# EAGLE design ESP8266_dev (EAGLE 8.0.2)
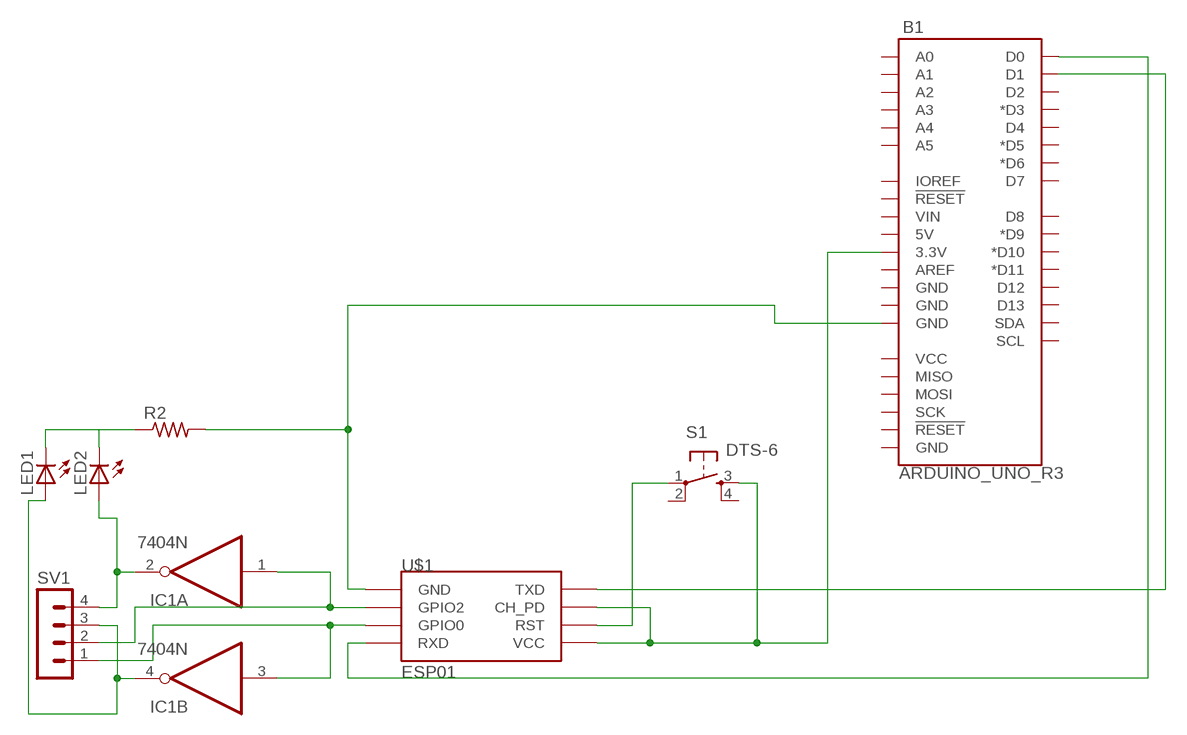
[diagram p0: schematic, sheet 1]

## Parts
B1  ARDUINO_UNO_R3  [ARDUINO_R3]
IC1  7404N  [DIL14]
LED1  LED3MM  [LED3MM]
LED2  LED3MM  [LED3MM]
R2  R-US_0207/15  [0207/15]
S1  DTS-6  [DTS-6]
SV1  MA04-1  [MA04-1]
U$1  ESP01  [ESP01]

## Nets
N$1: B1.3.3V S1.3 U$1.CH_PD U$1.VCC
N$2: S1.1 U$1.RST
N$3: B1.D1 U$1.TX(TXD)
N$4: B1.D0 U$1.RX(RXD)
N$5: B1.GND@2(GND) R2.2 U$1.GND
N$6: IC1.1(A:I) SV1.2 U$1.GPIO2
N$7: IC1.3(B:I) SV1.1 U$1.GPIO0
N$8: IC1.4(B:O) LED1.A SV1.3
N$9: IC1.2(A:O) LED2.A SV1.4
N$10: LED1.K(C) LED2.K(C) R2.1
Unconnected: B1.5V B1.A0 B1.A1 B1.A2 B1.A3 B1.A4 B1.A5 B1.AREF B1.D2 B1.D3(*D3) B1.D4 B1.D5(*D5) B1.D6(*D6) B1.D7 B1.D8 B1.D9(*D9) B1.D10(*D10) B1.D11(*D11) B1.D12 B1.D13 B1.GND@1(GND) B1.GND@3(GND) B1.GND@4(GND) B1.IOREF B1.MISO B1.MOSI B1.RESET@1(!RESET!) B1.RESET@2(!RESET!) B1.SCK B1.SCL B1.SDA B1.VCC B1.VIN IC1.5(C:I) IC1.6(C:O) IC1.8(D:O) IC1.9(D:I) IC1.10(E:O) IC1.11(E:I) IC1.12(F:O) IC1.13(F:I) S1.2 S1.4

## Power pins joined to a net without a drawn wire
GND: IC1.7(P:GND)
VCC: IC1.14(P:VCC)

## Library data of the parts
B1 = SparkFun-Boards:ARDUINO_UNO_R3: Arduino R3 Footprint with SPI header Arduino Uno R3 Compatible Footprint. Matches PCB size of the original board. SparkFun Products: SAMD21 Dev Breakout <https://www.sparkfun.com/products/13672> RedBoard <https://www.sparkfun.com/products/12757> R3 Stackable Headers <https://www.sparkfun.com/products/11417>
IC1 = 74xx-us:74*04: Hex INVERTER
LED1 LED2 = led:LED: LED OSRAM: - CHIPLED LG R971, LG N971, LY N971, LG Q971, LY Q971, LO R971, LY R971 LH N974, LH R974 LS Q976, LO Q976, LY Q976 LO Q996 - Hyper CHIPLED LW Q18S LB Q993, LB Q99A, LB R99A - SideLED LS A670, LO A670, LY A670, LG A670, LP A670 LB A673, LV A673, LT A673, LW A673 LH A674 LY A675 LS A676, LA A676, LO A676, LY A676, LW A676 LS A679, LY A679, LG A679 - Hyper Micro SIDELED® LS Y876, LA Y876, LO Y876, LY Y876 LT Y87S - SmartLED LW L88C, LW L88S LB L89C, LB L89S, LG L890 LS L89K, LO L89K, LY L89K LS L896, LA L896, LO L896, LY L896 - TOPLED LS T670, LO T670, LY T670, LG T670, LP T670 LSG T670, LSP T670, LSY T670, LOP T670, LYG T670 LG T671, LOG T671, LSG T671 LB T673, LV T673, LT T673, LW T673 LH T674 LS T676, LA T676, LO T676, LY T676, LB T676, LH T676, LSB T676, LW T676 LB T67C, LV T67C, LT T67C, LS T67K, LO T67K, LY T67K, LW E67C LS E67B, LA E67B, LO E67B, LY E67B, LB E67C, LV E67C, LT E67C LW T67C LS T679, LY T679, LG T679 LS T770, LO T770, LY T770, LG T770, LP T770 LB T773, LV T773, LT T773, LW T773 LH T774 LS E675, LA E675, LY E675, LS T675 LS T776, LA T776, LO T776, LY T776, LB T776 LHGB T686 LT T68C, LB T68C - Hyper Mini TOPLED® LB M676 - Mini TOPLED Santana® LG M470 LS M47K, LO M47K, LY M47K Source: http://www.osram.convergy.de LUXEON: - LUMILED® LXK2-PW12-R00, LXK2-PW12-S00, LXK2-PW14-U00, LXK2-PW14-V00 LXK2-PM12-R00, LXK2-PM12-S00, LXK2-PM14-U00 LXK2-PE12-Q00, LXK2-PE12-R00, LXK2-PE12-S00, LXK2-PE14-T00, LXK2-PE14-U00 LXK2-PB12-K00, LXK2-PB12-L00, LXK2-PB12-M00, LXK2-PB14-N00, LXK2-PB14-P00, LXK2-PB14-Q00 LXK2-PR12-L00, LXK2-PR12-M00, LXK2-PR14-Q00, LXK2-PR14-R00 LXK2-PD12-Q00, LXK2-PD12-R00, LXK2-PD12-S00 LXK2-PH12-R00, LXK2-PH12-S00 LXK2-PL12-P00, LXK2-PL12-Q00, LXK2-PL12-R00 Source: www.luxeon.com KINGBRIGHT: KA-3528ASYC Source: www.kingbright.com
R2 = resistor:R-US_: RESISTOR, American symbol
S1 = switch-tact:DTS-6
SV1 = con-lstb:MA04-1: PIN HEADER; OC_FARNELL: unknown; OC_NEWARK: unknown
U$1 = esp8266modules:ESP01: ESP8266 Wifi module 01

## Board
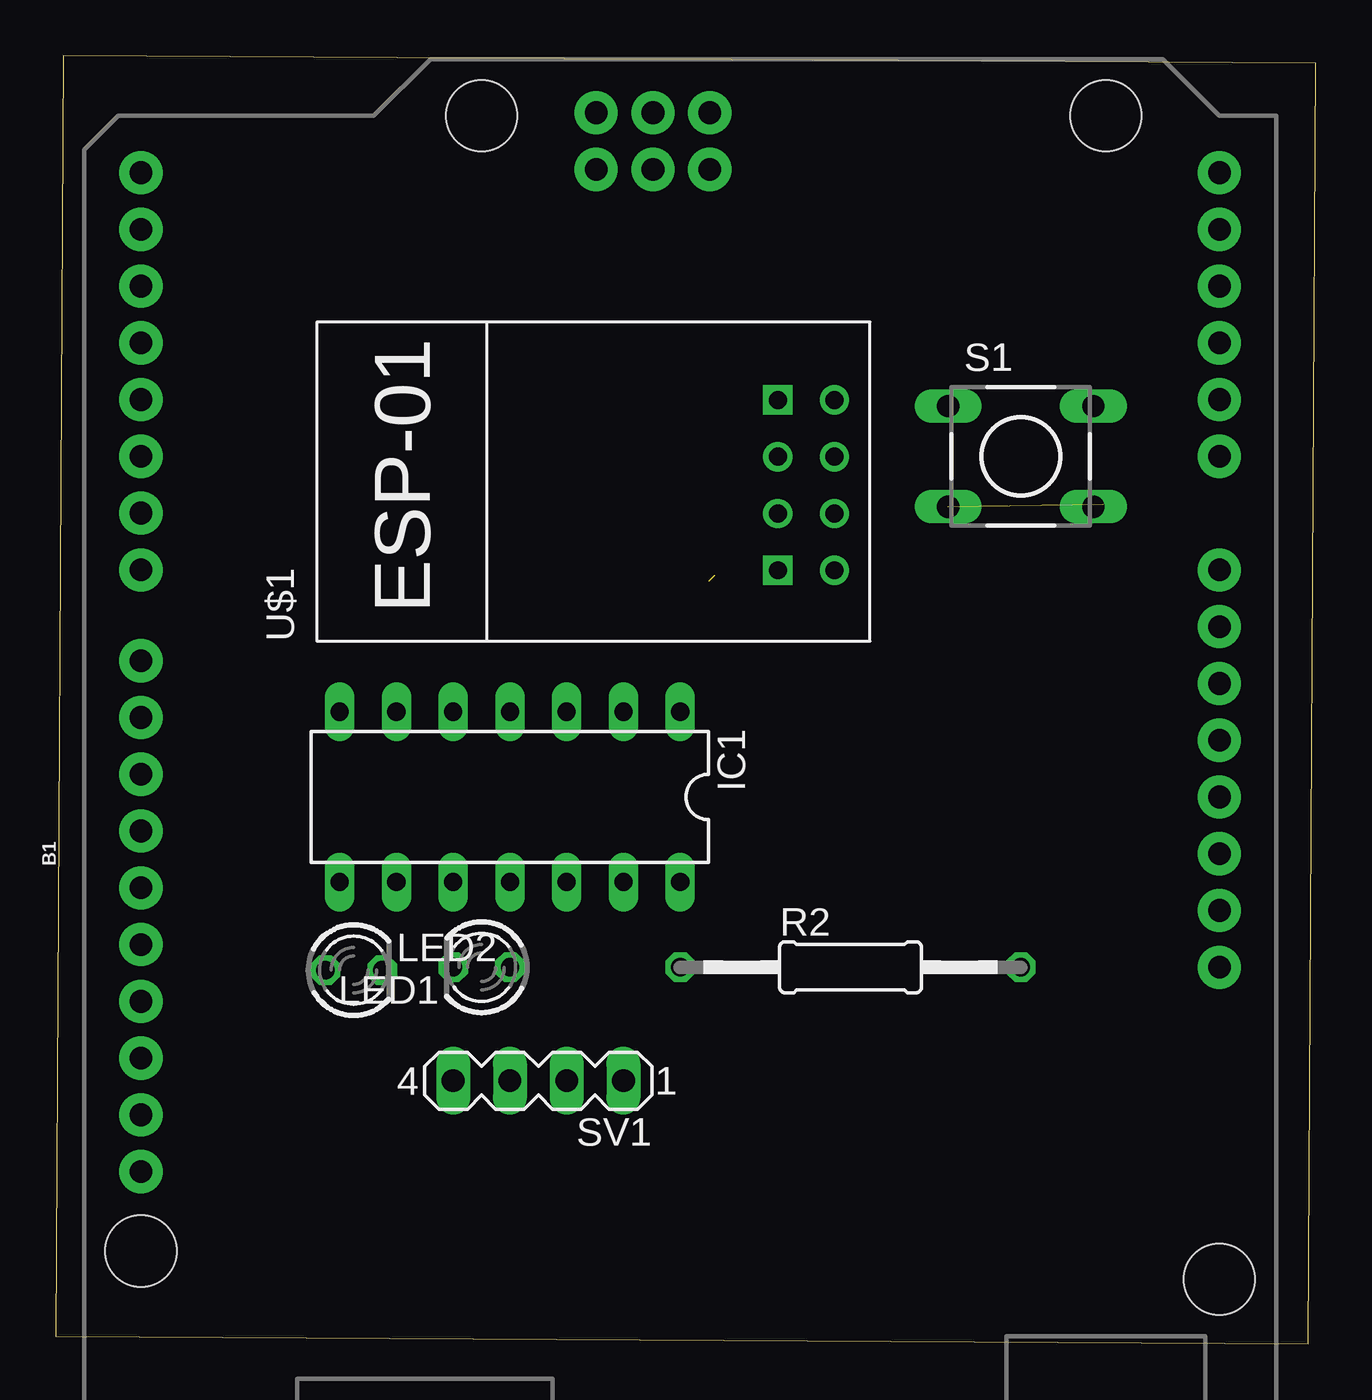
[diagram p1: board, top side]
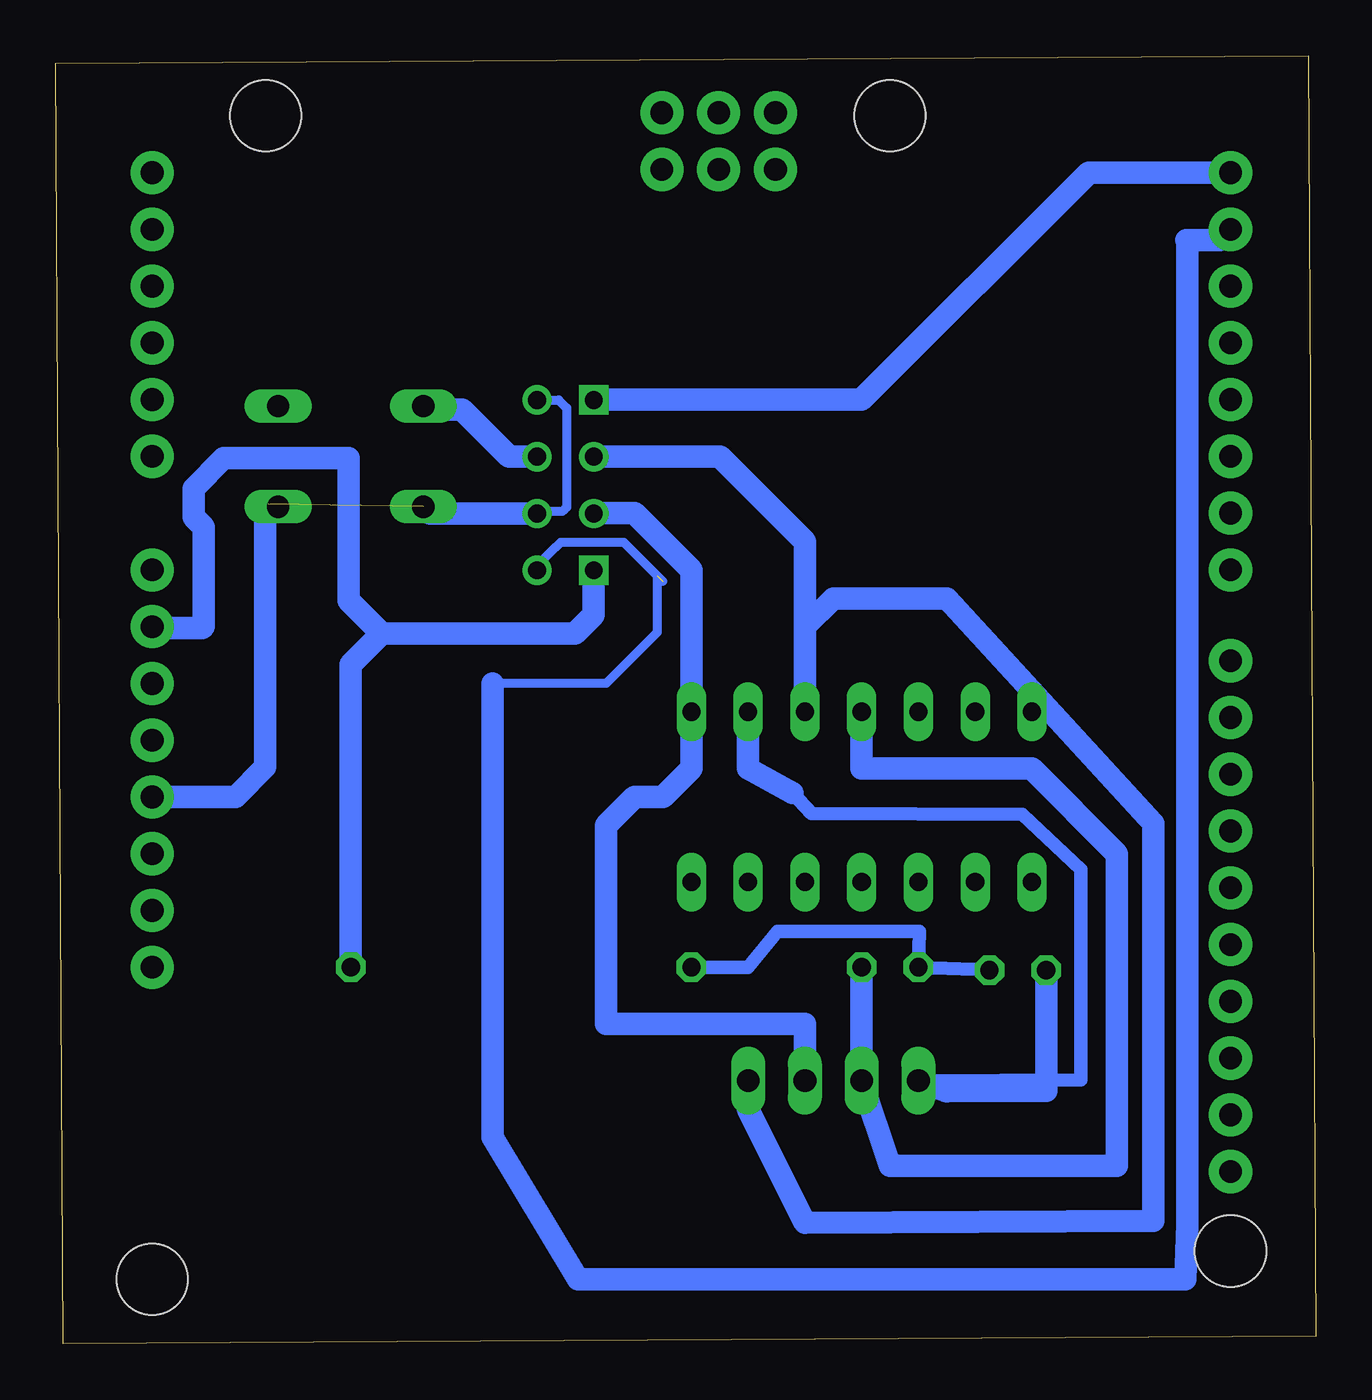
[diagram p2: board, bottom side, seen from below]

Size 56.38 x 57.63 mm. Coordinates in mm from the lower left corner, seen from the top.
Outline: 0,0.33 56.05,0 56.38,57.29 0.33,57.63 0,0.33
Copper layers (1*16): Top 0.035mm / dielectric 1.5mm / Bottom 0.035mm
Design rules "default": minimum track width 10mil, minimum drill 24mil, track to track 8mil, track to pad 8mil, pad to pad 8mil, via to via 8mil, smd to smd 8mil, copper to edge 40mil, drill to drill 8mil, minimum pad ring 10mil, minimum via ring 8mil, stop-mask expansion 4mil, vias tented up to drill 0mil, thermal gap 10mil

### Footprints (pad centres in the part's own frame; a part is rotated, then mirrored left to right if it is on the bottom)
ARDUINO_R3 = drill 1.016 pad 1.93: 3.3V 2.54,-24.13; 5V 5.08,-24.13; A0 17.78,-24.13; A1 20.32,-24.13; A2 22.86,-24.13; A3 25.4,-24.13; A4 27.94,-24.13; A5 30.48,-24.13; AREF -9.144,24.13; D0 30.48,24.13; D1 27.94,24.13; D2 25.4,24.13; D3 22.86,24.13; D4 20.32,24.13; D5 17.78,24.13; D6 15.24,24.13; D7 12.7,24.13; D8 8.636,24.13; D9 6.096,24.13; D10 3.556,24.13; D11 1.016,24.13; D12 -1.524,24.13; D13 -4.064,24.13; GND@1 7.62,-24.13; GND@2 10.16,-24.13; GND@3 -6.604,24.13; GND@4 33.16,-1.32; IOREF -2.54,-24.13; MISO 30.62,3.76; MOSI 33.16,1.22; NC -5.08,-24.13; RESET@1 0,-24.13; RESET@2 30.62,-1.32; SCK 30.62,1.22; SCL -14.224,24.13; SDA -11.684,24.13; VCC 33.16,3.76; VIN 12.7,-24.13 | hole 3.175: -17.78,24.13; 33.02,8.89; 33.02,-19.05; -19.05,-24.13
DIL14 = drill 0.813 long: 1 -7.62,-3.81; 2 -5.08,-3.81; 3 -2.54,-3.81; 4 0,-3.81; 5 2.54,-3.81; 6 5.08,-3.81; 7 7.62,-3.81; 8 7.62,3.81; 9 5.08,3.81; 10 2.54,3.81; 11 0,3.81; 12 -2.54,3.81; 13 -5.08,3.81; 14 -7.62,3.81
LED3MM = drill 0.813 octagon: A -1.27,0; K 1.27,0
0207/15 = drill 0.813 octagon: 1 -7.62,0; 2 7.62,0
DTS-6 = drill 1 long: 1 -3.25,2.25; 2 3.25,2.25; 3 -3.25,-2.25; 4 3.25,-2.25
MA04-1 = drill 1.016 long: 1 -3.81,0; 2 -1.27,0; 3 1.27,0; 4 3.81,0
ESP01 = drill 0.8: CH_PD -1.285,-8.178; GPIO0 1.255,-5.638; GPIO2 -1.285,-5.638; RST 1.255,-8.178; TX -3.825,-8.178; VCC 3.795,-8.178 | drill 0.8 square: GND -3.825,-5.638; RX 3.795,-5.638

### Placement (x,y rotation side)
B1  27.94,21.92 90 top
IC1  20.32,24.46 180 top
LED1  19.05,16.84 180 top
LED2  13.33,16.71 0 top
R2  35.56,16.84 0 top
S1  43.18,39.7 0 top
SV1  21.59,11.76 180 top
U$1  26.67,38.43 90 top

### Tracks (layer width: path | path; a pad name or v marks a point on that pad's centre or on a via)
N$1  (1 unrouted)
  Bottom 0.406: U$1.VCC 33.88,42.23 33.52,41.87 33.52,37.43 33.71,37.24 34.76,37.24 U$1.CH_PD
  Bottom 1.016: U$1.CH_PD 39.62,37.15 S1.3 | B1.3.3V 48.34,24.46 47.01,25.79 47.01,37.43 46.88,37.56
N$2
  Bottom 1.016: U$1.RST 36.09,39.69 38.21,41.8 39.78,41.8 S1.1
N$3  (1 unrouted)
  Bottom 0.406: U$1.TX 34.85,34.82 34.03,35.63 34.01,35.63 33.78,35.86 30.97,35.86 29.21,34.11 | 29.47,34.36 29.47,31.82 31.75,29.54 36.83,29.54
  Bottom 1.016: 36.83,29.54 36.83,9.22 33.02,2.87 5.83,2.87 5.75,5.33 5.75,49.36 5.78,49.39 4.28,49.39 B1.D1
N$4
  Bottom 1.016: B1.D0 10.16,52.4 20.32,42.24 32.29,42.24 U$1.RX
N$5
  Bottom 1.016: U$1.GND 32.31,32.6 33.13,31.77 41.8,31.77 | 41.8,31.77 43.28,33.25 43.28,39.62 48.87,39.62 50.22,38.27 50.22,36.98 49.77,36.53 49.77,32.1 49.83,32.03 52.02,32.03 B1.GND@2 | R2.2 43.18,30.4 41.8,31.77
N$6
  Bottom 1.016: U$1.GPIO2 32.29,37.16 30.48,37.16 27.94,34.62 IC1.1 27.94,25.73 29.21,24.46 30.48,24.46 31.75,23.19 31.75,14.3 22.86,14.3 SV1.2
N$7
  Bottom 1.016: U$1.GPIO0 26.66,39.69 22.86,35.89 22.86,32.08 | IC1.3 22.86,32.08 | 22.86,32.08 21.59,33.35 16.51,33.35 7.28,23.27 7.28,5.49 22.86,5.41 25.4,10.49 SV1.1
N$8
  Bottom 1.016: IC1.4 20.32,25.73 12.7,25.73 8.89,21.92 8.89,7.95 19.05,7.95 SV1.3 LED1.A
N$9
  Bottom 0.61: 23.41,24.64 22.57,23.72 13.12,23.68 10.52,21.23 10.5,11.8 SV1.4
  Bottom 1.016: IC1.2 25.4,25.73 23.41,24.64 | SV1.4 16.51,11.29 12.06,11.32 LED2.A
N$10
  Bottom 0.61: LED2.K LED1.K 17.74,18.45 24.09,18.45 25.4,16.84 R2.1